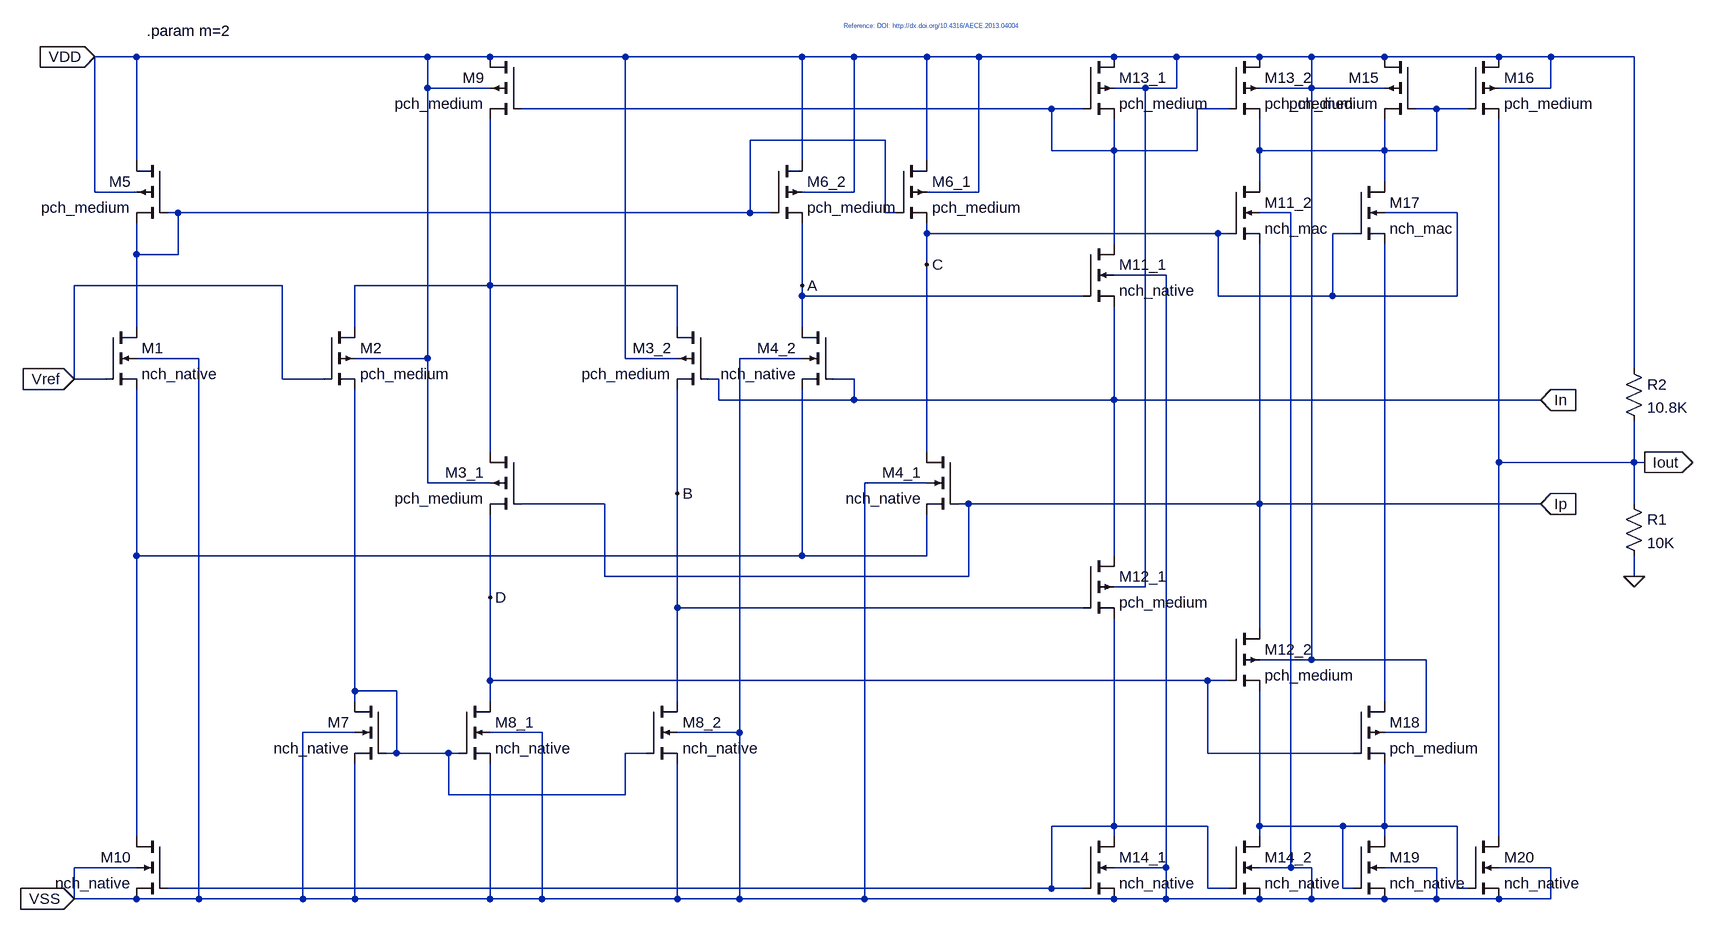
[diagram p0: schematic CBPlusSubtractor.asc]
CBPlusSubtractor.asc, the LTspice schematic file:
Version 4
SHEET 1 1512 1456
WIRE -1184 64 -1248 64
WIRE -736 64 -1184 64
WIRE -640 64 -736 64
WIRE -432 64 -640 64
WIRE -160 64 -432 64
WIRE -80 64 -160 64
WIRE 32 64 -80 64
WIRE 112 64 32 64
WIRE 320 64 112 64
WIRE 416 64 320 64
WIRE 544 64 416 64
WIRE 624 64 544 64
WIRE 736 64 624 64
WIRE 912 64 736 64
WIRE 992 64 912 64
WIRE 1120 64 992 64
WIRE -736 112 -736 64
WIRE -640 112 -736 112
WIRE 368 112 320 112
WIRE 416 112 416 64
WIRE 416 112 368 112
WIRE 624 112 624 64
WIRE 624 112 544 112
WIRE 736 112 624 112
WIRE 992 112 992 64
WIRE 992 112 912 112
WIRE 224 144 -592 144
WIRE 272 144 224 144
WIRE 496 144 448 144
WIRE 816 144 784 144
WIRE 864 144 816 144
WIRE -32 192 -240 192
WIRE 224 208 224 144
WIRE 320 208 320 160
WIRE 320 208 224 208
WIRE 448 208 448 144
WIRE 448 208 320 208
WIRE 544 208 544 160
WIRE 736 208 736 160
WIRE 736 208 544 208
WIRE 816 208 816 144
WIRE 816 208 736 208
WIRE -1184 224 -1184 64
WIRE -160 224 -160 64
WIRE 32 224 32 64
WIRE 544 256 544 208
WIRE 736 256 736 208
WIRE -1248 272 -1248 64
WIRE -1184 272 -1248 272
WIRE -80 272 -80 64
WIRE -80 272 -160 272
WIRE 112 272 112 64
WIRE 112 272 32 272
WIRE -1120 304 -1136 304
WIRE -240 304 -240 192
WIRE -240 304 -1120 304
WIRE -208 304 -240 304
WIRE -32 304 -32 192
WIRE -16 304 -32 304
WIRE 592 304 544 304
WIRE 848 304 736 304
WIRE 32 336 32 320
WIRE 480 336 32 336
WIRE 496 336 480 336
WIRE 688 336 656 336
WIRE 320 352 320 208
WIRE -1184 368 -1184 320
WIRE -1120 368 -1120 304
WIRE -1120 368 -1184 368
WIRE 32 384 32 336
WIRE 400 400 320 400
WIRE -960 416 -1280 416
WIRE -640 416 -640 160
WIRE -640 416 -848 416
WIRE -352 416 -640 416
WIRE -160 416 -160 320
WIRE -160 432 -160 416
WIRE 272 432 -160 432
WIRE 480 432 480 336
WIRE 656 432 656 336
WIRE 656 432 480 432
WIRE 848 432 848 304
WIRE 848 432 656 432
WIRE -1184 480 -1184 368
WIRE -848 480 -848 416
WIRE -352 480 -352 416
WIRE -160 480 -160 432
WIRE -1088 528 -1184 528
WIRE -736 528 -736 112
WIRE -736 528 -848 528
WIRE -432 528 -432 64
WIRE -352 528 -432 528
WIRE -160 528 -256 528
WIRE 1120 544 1120 64
WIRE -1280 560 -1280 416
WIRE -1232 560 -1280 560
WIRE -960 560 -960 416
WIRE -896 560 -960 560
WIRE -288 560 -304 560
WIRE -80 560 -112 560
WIRE -288 592 -288 560
WIRE -80 592 -80 560
WIRE -80 592 -288 592
WIRE 320 592 320 448
WIRE 320 592 -80 592
WIRE 976 592 320 592
WIRE -640 672 -640 416
WIRE 32 672 32 384
WIRE 912 688 912 160
WIRE 1120 688 1120 624
WIRE 1120 688 912 688
WIRE 1136 688 1120 688
WIRE -736 720 -736 528
WIRE -640 720 -736 720
WIRE 32 720 -64 720
WIRE -352 736 -352 576
WIRE -464 752 -592 752
WIRE 96 752 80 752
WIRE 544 752 544 352
WIRE 544 752 96 752
WIRE 976 752 544 752
WIRE 1120 752 1120 688
WIRE -1184 832 -1184 576
WIRE -160 832 -160 576
WIRE -160 832 -1184 832
WIRE 32 832 32 768
WIRE 32 832 -160 832
WIRE 320 832 320 592
WIRE -464 864 -464 752
WIRE 96 864 96 752
WIRE 96 864 -464 864
WIRE 1120 864 1120 832
WIRE 368 880 368 112
WIRE 368 880 320 880
WIRE -640 896 -640 768
WIRE -352 912 -352 736
WIRE 272 912 -352 912
WIRE 544 944 544 752
WIRE 624 992 624 112
WIRE 624 992 544 992
WIRE 800 992 624 992
WIRE -640 1024 -640 896
WIRE 464 1024 -640 1024
WIRE 496 1024 464 1024
WIRE -848 1040 -848 576
WIRE -784 1040 -848 1040
WIRE -848 1056 -848 1040
WIRE -640 1056 -640 1024
WIRE -352 1056 -352 912
WIRE 736 1056 736 352
WIRE -848 1104 -928 1104
WIRE -560 1104 -640 1104
WIRE -256 1104 -256 528
WIRE -256 1104 -352 1104
WIRE 800 1104 800 992
WIRE 800 1104 736 1104
WIRE -784 1136 -784 1040
WIRE -784 1136 -800 1136
WIRE -704 1136 -784 1136
WIRE -688 1136 -704 1136
WIRE -400 1136 -432 1136
WIRE 464 1136 464 1024
WIRE 688 1136 464 1136
WIRE -704 1200 -704 1136
WIRE -432 1200 -432 1136
WIRE -432 1200 -704 1200
WIRE 320 1248 320 928
WIRE 320 1248 224 1248
WIRE 464 1248 320 1248
WIRE 544 1248 544 1040
WIRE 672 1248 544 1248
WIRE 736 1248 736 1152
WIRE 736 1248 672 1248
WIRE 848 1248 736 1248
WIRE -1184 1264 -1184 832
WIRE 320 1264 320 1248
WIRE 544 1264 544 1248
WIRE 736 1264 736 1248
WIRE 912 1264 912 688
WIRE -1184 1312 -1280 1312
WIRE 400 1312 400 400
WIRE 400 1312 320 1312
WIRE 592 1312 592 304
WIRE 592 1312 544 1312
WIRE 624 1312 592 1312
WIRE 816 1312 736 1312
WIRE 992 1312 912 1312
WIRE 224 1344 224 1248
WIRE 224 1344 -1136 1344
WIRE 272 1344 224 1344
WIRE 464 1344 464 1248
WIRE 496 1344 464 1344
WIRE 672 1344 672 1248
WIRE 688 1344 672 1344
WIRE 848 1344 848 1248
WIRE 864 1344 848 1344
WIRE -1280 1360 -1280 1312
WIRE -1184 1360 -1280 1360
WIRE -1088 1360 -1088 528
WIRE -1088 1360 -1184 1360
WIRE -928 1360 -928 1104
WIRE -928 1360 -1088 1360
WIRE -848 1360 -848 1152
WIRE -848 1360 -928 1360
WIRE -640 1360 -640 1152
WIRE -640 1360 -848 1360
WIRE -560 1360 -560 1104
WIRE -560 1360 -640 1360
WIRE -352 1360 -352 1152
WIRE -352 1360 -560 1360
WIRE -256 1360 -256 1104
WIRE -256 1360 -352 1360
WIRE -64 1360 -64 720
WIRE -64 1360 -256 1360
WIRE 320 1360 -64 1360
WIRE 400 1360 400 1312
WIRE 400 1360 320 1360
WIRE 544 1360 400 1360
WIRE 624 1360 624 1312
WIRE 624 1360 544 1360
WIRE 736 1360 624 1360
WIRE 816 1360 816 1312
WIRE 816 1360 736 1360
WIRE 912 1360 816 1360
WIRE 992 1360 992 1312
WIRE 992 1360 912 1360
FLAG -160 416 A
FLAG 32 384 C
FLAG -352 736 B
FLAG -640 896 D
FLAG 976 592 In
IOPIN 976 592 In
FLAG 976 752 Ip
IOPIN 976 752 In
FLAG -1248 64 VDD
IOPIN -1248 64 In
FLAG -1280 1360 VSS
IOPIN -1280 1360 In
FLAG -1280 560 Vref
IOPIN -1280 560 In
FLAG 1136 688 Iout
IOPIN 1136 688 Out
FLAG 1120 864 0
SYMBOL pmos4 864 64 R0
SYMATTR InstName M16
SYMATTR Value pch_medium
SYMATTR Value2 l=500n w=30u m={m}
SYMBOL pmos4 784 64 M0
SYMATTR InstName M15
SYMATTR Value pch_medium
SYMATTR Value2 l=500n w=30u m={m}
SYMBOL nmos4 272 352 R0
SYMATTR InstName M11_1
SYMATTR Value nch_native
SYMATTR Value2 l=0.5u w=20u m={m}
SYMBOL nmos4 -112 480 M0
SYMATTR InstName M4_2
SYMATTR Value nch_native
SYMATTR Value2 l=500n w=30u m={m}
SYMBOL pmos4 496 64 R0
SYMATTR InstName M13_2
SYMATTR Value pch_medium
SYMATTR Value2 l=500n w=30u m={m}
SYMBOL pmos4 272 64 R0
SYMATTR InstName M13_1
SYMATTR Value pch_medium
SYMATTR Value2 l=500n w=30u m={m}
SYMBOL pmos4 -592 64 M0
SYMATTR InstName M9
SYMATTR Value pch_medium
SYMATTR Value2 l=500n w=30u m={m}
SYMBOL pmos4 -16 224 R0
SYMATTR InstName M6_1
SYMATTR Value pch_medium
SYMATTR Value2 l=500n w=60u m={m}
SYMBOL pmos4 -208 224 R0
SYMATTR InstName M6_2
SYMATTR Value pch_medium
SYMATTR Value2 l=500n w=60u m={m}
SYMBOL pmos4 -1136 224 M0
SYMATTR InstName M5
SYMATTR Value pch_medium
SYMATTR Value2 l=500n w=60u m={m}
SYMBOL nmos4 -1232 480 R0
SYMATTR InstName M1
SYMATTR Value nch_native
SYMATTR Value2 l=500n w=30u m={m}
SYMBOL pmos4 -896 480 R0
SYMATTR InstName M2
SYMATTR Value pch_medium
SYMATTR Value2 l=500n w=90u m={m}
SYMBOL pmos4 -304 480 M0
SYMATTR InstName M3_2
SYMATTR Value pch_medium
SYMATTR Value2 l=500n w=90u m={m}
SYMBOL pmos4 -592 672 M0
SYMATTR InstName M3_1
SYMATTR Value pch_medium
SYMATTR Value2 l=500n w=90u m={m}
SYMBOL nmos4 -1136 1264 M0
SYMATTR InstName M10
SYMATTR Value nch_native
SYMATTR Value2 l=500n w=15u m={m}
SYMBOL nmos4 -800 1056 M0
SYMATTR InstName M7
SYMATTR Value nch_native
SYMATTR Value2 l=500n w=20u m={m}
SYMBOL nmos4 -688 1056 R0
SYMATTR InstName M8_1
SYMATTR Value nch_native
SYMATTR Value2 l=500n w=20u m={m}
SYMBOL nmos4 -400 1056 R0
SYMATTR InstName M8_2
SYMATTR Value nch_native
SYMATTR Value2 l=500n w=20u m={m}
SYMBOL nmos4 496 256 R0
SYMATTR InstName M11_2
SYMATTR Value nch_mac
SYMATTR Value2 l=500n w=20u m={m}
SYMBOL pmos4 496 944 R0
SYMATTR InstName M12_2
SYMATTR Value pch_medium
SYMATTR Value2 l=500n w=60u m={m}
SYMBOL nmos4 864 1264 R0
SYMATTR InstName M20
SYMATTR Value nch_native
SYMATTR Value2 l=500n w=10u m={m}
SYMBOL nmos4 688 1264 R0
SYMATTR InstName M19
SYMATTR Value nch_native
SYMATTR Value2 l=500n w=10u m={m}
SYMBOL nmos4 496 1264 R0
SYMATTR InstName M14_2
SYMATTR Value nch_native
SYMATTR Value2 l=500n w=10u m={m}
SYMBOL nmos4 272 1264 R0
SYMATTR InstName M14_1
SYMATTR Value nch_native
SYMATTR Value2 l=500n w=10u m={m}
SYMBOL pmos4 272 832 R0
SYMATTR InstName M12_1
SYMATTR Value pch_medium
SYMATTR Value2 l=500n w=60u m={m}
SYMBOL nmos4 80 672 M0
SYMATTR InstName M4_1
SYMATTR Value nch_native
SYMATTR Value2 l=500n w=30u m={m}
SYMBOL nmos4 688 256 R0
SYMATTR InstName M17
SYMATTR Value nch_mac
SYMATTR Value2 l=500n w=20u m={m}
SYMBOL pmos4 688 1056 R0
SYMATTR InstName M18
SYMATTR Value pch_medium
SYMATTR Value2 l=500n w=60u m={m}
SYMBOL res 1104 736 R0
SYMATTR InstName R1
SYMATTR Value 10K
SYMBOL res 1104 528 R0
SYMATTR InstName R2
SYMATTR Value 10.8K
TEXT -96 16 Left 0 ;Reference: DOI: http://dx.doi.org/10.4316/AECE.2013.04004
TEXT -1168 24 Left 2 !.param m=2

The netlist it stands for:
* CBPlusSubtractor.asc
M16 VDD N002 Iout VDD pch_medium l=500n w=30u m={m}
M15 VDD N002 N002 VDD pch_medium l=500n w=30u m={m}
M11_1 N001 A In VSS nch_native l=0.5u w=20u m={m}
M4_2 A In N005 VSS nch_native l=500n w=30u m={m}
M13_2 VDD N001 N002 VDD pch_medium l=500n w=30u m={m}
M13_1 VDD N001 N001 VDD pch_medium l=500n w=30u m={m}
M9 VDD N001 N004 VDD pch_medium l=500n w=30u m={m}
M6_1 VDD N003 C VDD pch_medium l=500n w=60u m={m}
M6_2 VDD N003 A VDD pch_medium l=500n w=60u m={m}
M5 VDD N003 N003 VDD pch_medium l=500n w=60u m={m}
M1 N003 Vref N005 VSS nch_native l=500n w=30u m={m}
M2 N004 Vref N006 VDD pch_medium l=500n w=90u m={m}
M3_2 N004 In B VDD pch_medium l=500n w=90u m={m}
M3_1 N004 Ip D VDD pch_medium l=500n w=90u m={m}
M10 N005 N008 VSS VSS nch_native l=500n w=15u m={m}
M7 N006 N006 VSS VSS nch_native l=500n w=20u m={m}
M8_1 D N006 VSS VSS nch_native l=500n w=20u m={m}
M8_2 B N006 VSS VSS nch_native l=500n w=20u m={m}
M11_2 N002 C Ip VSS nch_mac l=500n w=20u m={m}
M12_2 Ip D N009 VDD pch_medium l=500n w=60u m={m}
M20 Iout N009 VSS VSS nch_native l=500n w=10u m={m}
M19 N009 N009 VSS VSS nch_native l=500n w=10u m={m}
M14_2 N009 N008 VSS VSS nch_native l=500n w=10u m={m}
M14_1 N008 N008 VSS VSS nch_native l=500n w=10u m={m}
M12_1 In B N008 VDD pch_medium l=500n w=60u m={m}
M4_1 C Ip N005 VSS nch_native l=500n w=30u m={m}
M17 N002 C N007 C nch_mac l=500n w=20u m={m}
M18 N007 D N009 VDD pch_medium l=500n w=60u m={m}
R1 Iout 0 10K
R2 VDD Iout 10.8K
.model NMOS NMOS
.model PMOS PMOS
.lib standard.mos
* Reference: DOI: http://dx.doi.org/10.4316/AECE.2013.04004
.param m=2
.backanno
.end